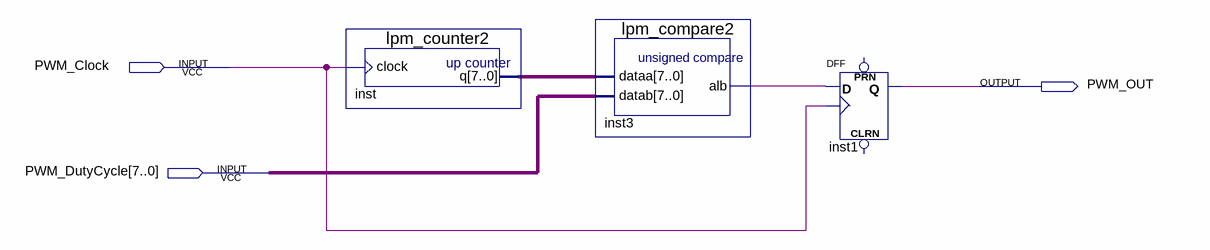
[diagram p0: schematic sheet]
// Quartus schematic PWM_generator.bdf as structural Verilog: 3 symbols, 3 pins
module PWM_generator (
  input  PWM_Clock,
  input  [7:0] PWM_DutyCycle,
  output PWM_OUT
);

  wire inst3_alb;
  wire [7:0] inst_q;

  lpm_counter2 inst (.clock(PWM_Clock), .q(inst_q));
  lpm_compare2 inst3 (.dataa(inst_q), .datab(PWM_DutyCycle), .alb(inst3_alb));
  DFF inst1 (.CLK(PWM_Clock), .D(inst3_alb), .Q(PWM_OUT));  // open: CLRN, PRN
endmodule
